# Altium schematic sheet BTN7960_DRIVER_SCH.SchDoc
size A2
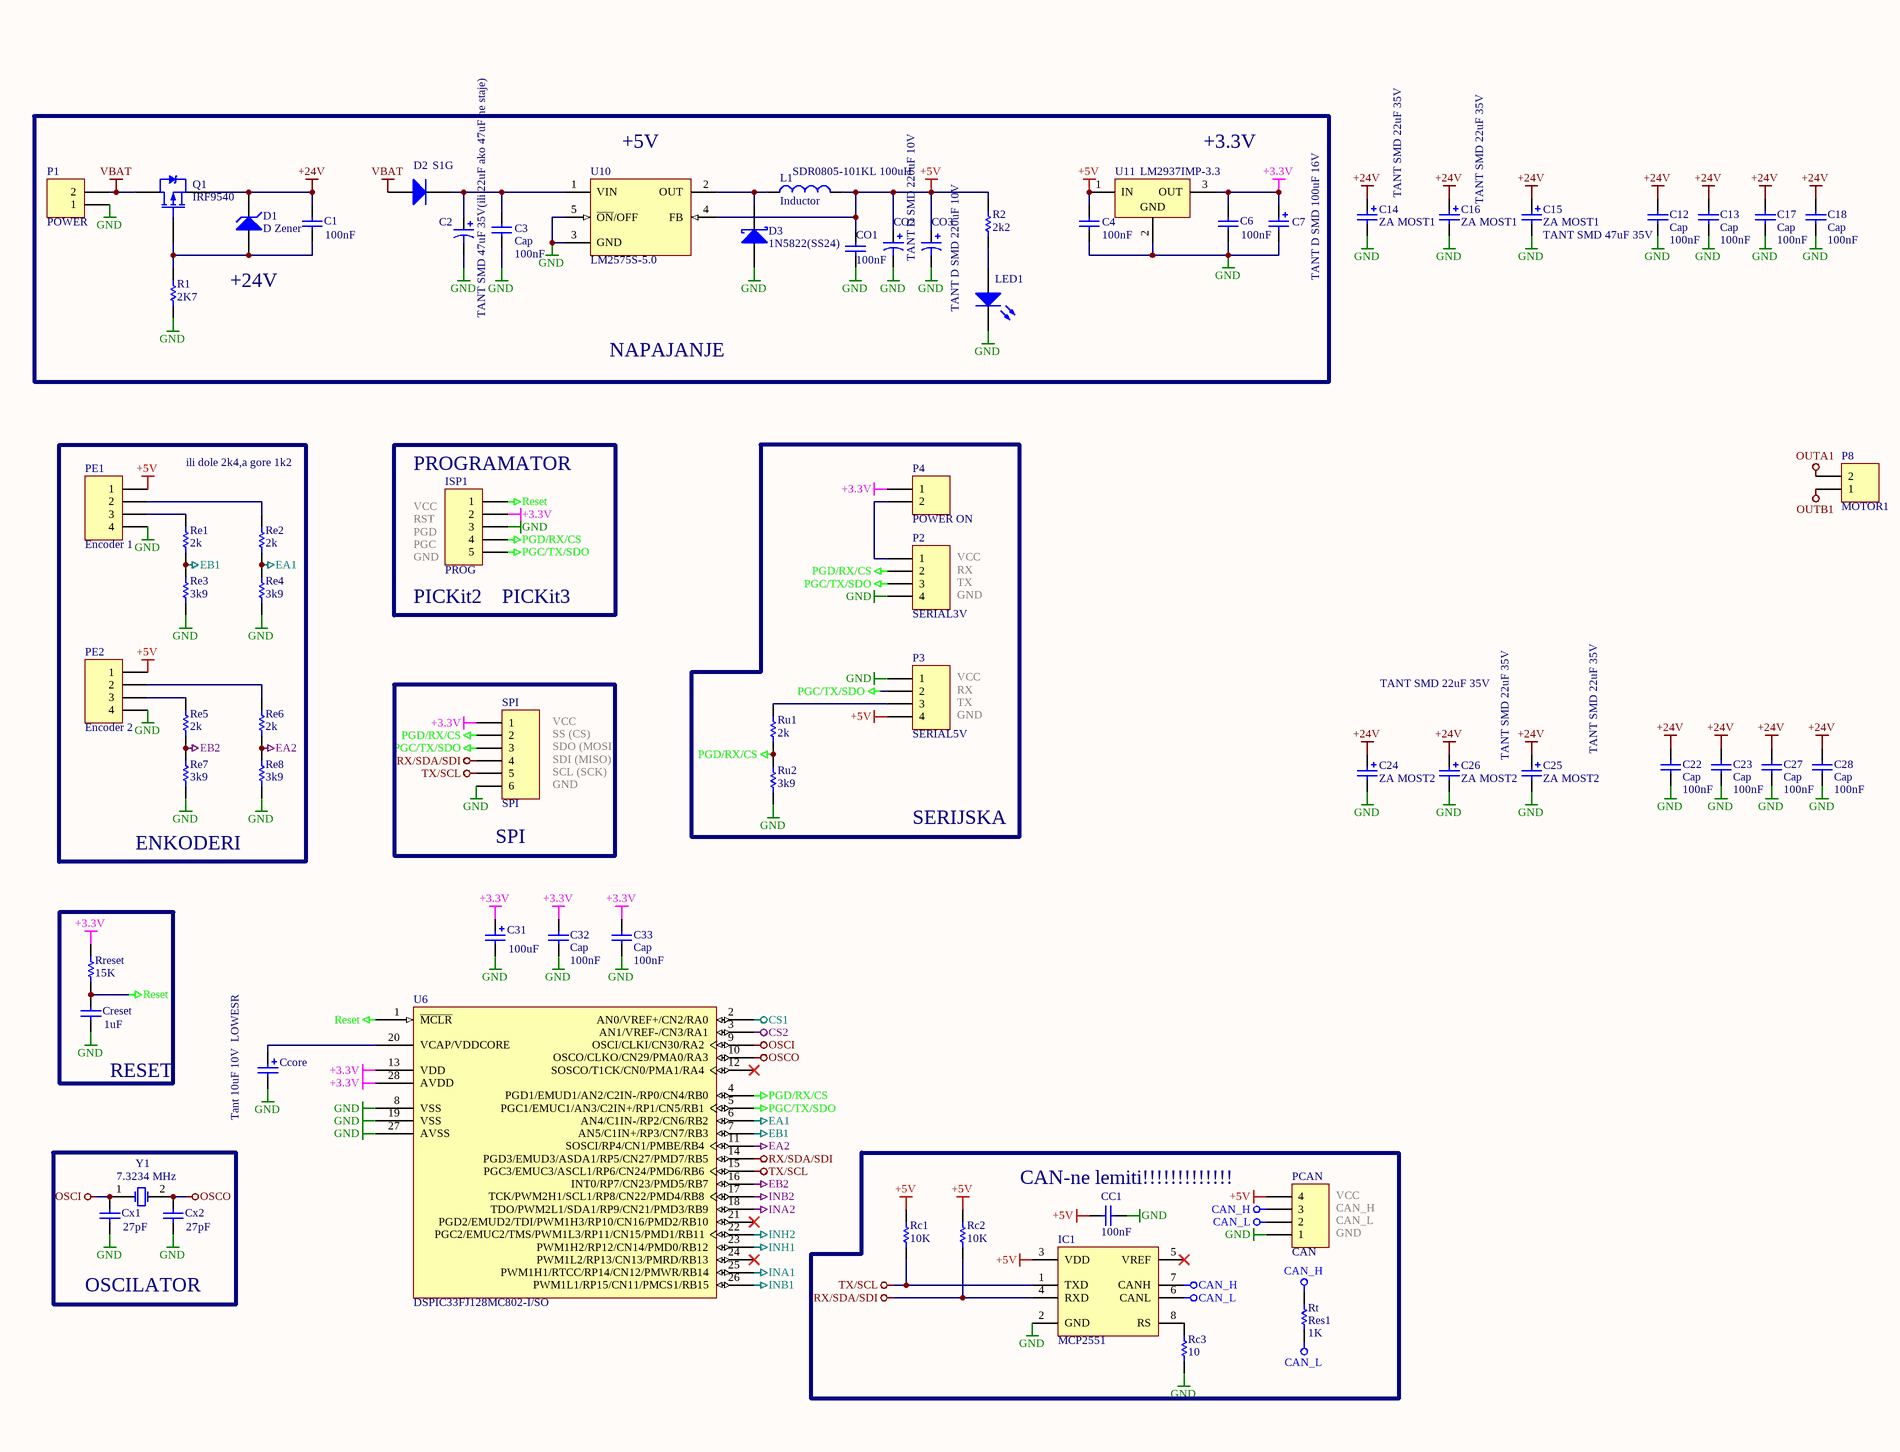
[diagram p0: BTN7960_DRIVER_SCH.SchDoc, left]
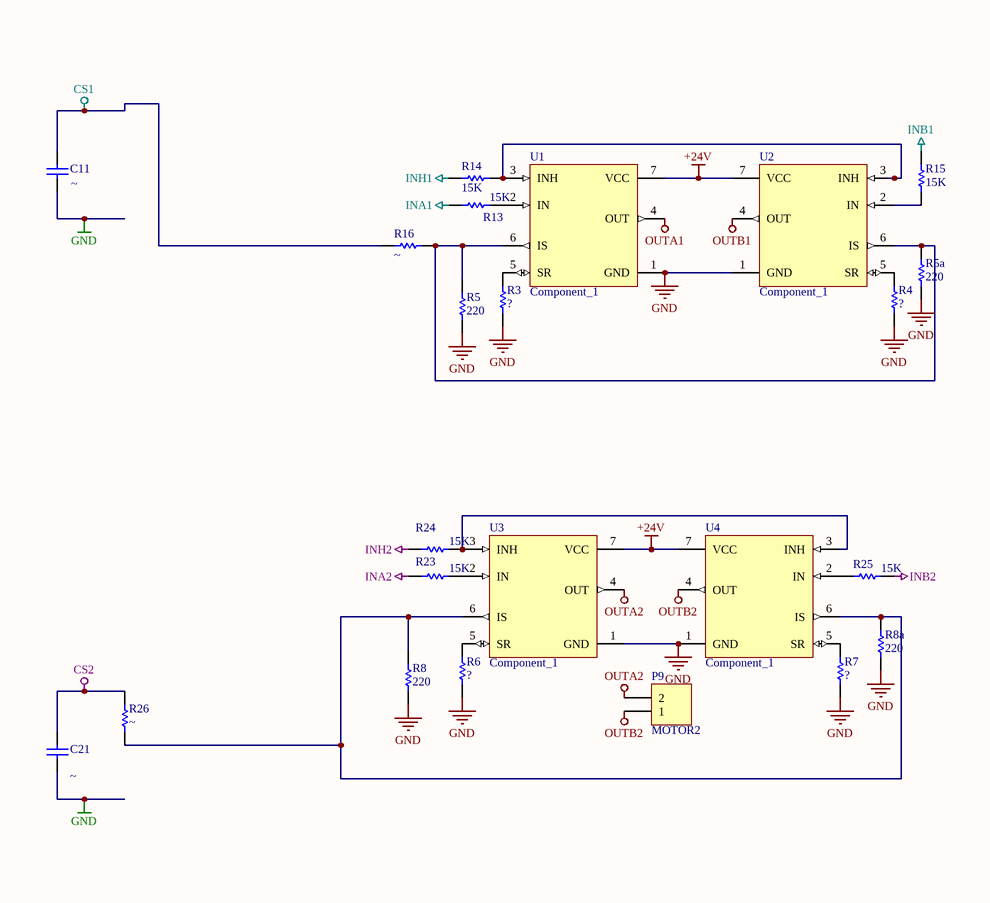
[diagram p1: BTN7960_DRIVER_SCH.SchDoc, right]

## Parts
C1  value 100nF  [1206]  (hidden comment: Cap)
C2  value TANT SMD 47uF 35V(ili 22uF ako 47uF ne staje)  [TC7343-2917]  (hidden comment: Cap Pol1)
C3  Cap  value 100nF  [1206]
C4  value 100nF  [1206]  (hidden comment: Cap)
C6  value 100nF  [1206]  (hidden comment: Cap)
C7  value TANT D SMD 100uF 16V  [TC7343-2917]  (hidden comment: ECAP)
C11  value ~  [1206]  (hidden comment: Cap)
C12  Cap  value 100nF  [1206]
C13  Cap  value 100nF  [1206]
C14  ZA MOST1  value TANT SMD 22uF 35V  [TC7343-2917]
C15  ZA MOST1  value TANT SMD 47uF 35V  [TC7343-2917]
C16  ZA MOST1  value TANT SMD 22uF 35V  [TC7343-2917]
C17  Cap  value 100nF  [1206]
C18  Cap  value 100nF  [1206]
C21  value ~  [1206]  (hidden comment: Cap)
C22  Cap  value 100nF  [1206]
C23  Cap  value 100nF  [1206]
C24  ZA MOST2  value TANT SMD 22uF 35V  [TC7343-2917]
C25  ZA MOST2  value TANT SMD 22uF 35V  [TC7343-2917]
C26  ZA MOST2  value TANT SMD 22uF 35V  [TC7343-2917]
C27  Cap  value 100nF  [1206]
C28  Cap  value 100nF  [1206]
C31  value 100uF  [TC7343-2917]  (hidden comment: ZA MOST1)
C32  Cap  value 100nF  [1206]
C33  Cap  value 100nF  [1206]
CC1  value 100nF  [1206]  (hidden comment: Cap)
Ccore  value Tant 10uF 10V  LOWESR  [TC7343-2917]  (hidden comment: ECAP)
CO1  value 100nF  [1206]  (hidden comment: Cap)
CO2  value TANT D SMD 220uF 10V  [TC7343-2917]  (hidden comment: Cap Pol1)
CO3  value TANT D SMD 220uF 10V  [TC7343-2917]  (hidden comment: Cap Pol1)
Creset  value 1uF  [1206]  (hidden comment: Cap)
Cx1  value 27pF  [1206]  (hidden comment: Cap)
Cx2  value 27pF  [1206]  (hidden comment: Cap)
D1  D Zener  [DSO-C2/X2.3]
D2  S1G  [DSO-C2/X2.3]
D3  1N5822(SS24)  [DSO-C2/X2.3]
IC1  MCP2551  [R-8_N]
ISP1  PROG  [HDR1X5]
L1  Inductor  value SDR0805-101KL 100uH  [SDR0805]
LD1  LED1  [RAD-0.1]
P1  POWER  [kombinacija]
P2  SERIAL3V  [HDR1X4]
P3  SERIAL5V  [BRXCON_4]
P4  POWER ON  [HDR1X2]
P8  MOTOR1  [kombinacija]
P9  MOTOR2  [kombinacija]
PCAN  CAN  [BRXCON_4]
PE1  Encoder 1  [BRXCON_4]
PE2  Encoder 2  [BRXCON_4]
Q1  IRF9540  [D2-PAK]
R1  value 2K7  [1206]  (hidden comment: res)
R2  value 2k2  [1206]  (hidden comment: res)
R3  res  [1206]  (value not drawn)
R4  res  [1206]  (value not drawn)
R5  value 220  [1206]  (hidden comment: res)
R5a  value 220  [1206]  (hidden comment: res)
R6  res  [1206]  (value not drawn)
R7  res  [1206]  (value not drawn)
R8  value 220  [1206]  (hidden comment: res)
R8a  value 220  [1206]  (hidden comment: res)
R13  value 15K  [1206]  (hidden comment: res)
R14  value 15K  [1206]  (hidden comment: res)
R15  value 15K  [1206]  (hidden comment: res)
R16  value ~  [1206]  (hidden comment: res)
R23  value 15K  [1206]  (hidden comment: res)
R24  value 15K  [1206]  (hidden comment: res)
R25  value 15K  [1206]  (hidden comment: res)
R26  value ~  [1206]  (hidden comment: res)
Rc1  value 10K  [1206]  (hidden comment: res)
Rc2  value 10K  [1206]  (hidden comment: res)
Rc3  value 10  [1206]  (hidden comment: res)
Re1  value 2k  [1206]  (hidden comment: res)
Re2  value 2k  [1206]  (hidden comment: res)
Re3  value 3k9  [1206]  (hidden comment: res)
Re4  value 3k9  [1206]  (hidden comment: res)
Re5  value 2k  [1206]  (hidden comment: res)
Re6  value 2k  [1206]  (hidden comment: res)
Re7  value 3k9  [1206]  (hidden comment: res)
Re8  value 3k9  [1206]  (hidden comment: res)
Rreset  value 15K  [1206]  (hidden comment: res)
Rt  Res1  value 1K  [1206]
Ru1  value 2k  [1206]  (hidden comment: res)
Ru2  value 3k9  [1206]  (hidden comment: res)
SPI  SPI  [BRXCON_6]
U1  Component_1  [to263-7]
U2  Component_1  [to263-7]
U3  Component_1  [to263-7]
U4  Component_1  [to263-7]
U6  DSPIC33FJ128MC802-I/SO  [SOIC-SO28_N]
U10  LM2575S-5.0  [TO-263(5)]
U11  LM2937IMP-3.3  [SOT223]
Y1  7.3234 MHz  [HC-49U]

## Nets
+3.3V: C6.2 C7.1 C31.1 C32.2 C33.2 ISP1.2 P4.1 Rreset.1 SPI.1 U6.13(VDD) U6.28(AVDD) U11.3(OUT)
+5V: C4.2 CC1.2 CO1.2 CO2.1 CO3.1 IC1.3(VDD) L1.2 P3.4 PCAN.4 PE1.1 PE2.1 R2.2 Rc1.1 Rc2.1 U10.4(FB) U11.1(IN)
+24V: C1.2 C12.2 C13.2 C14.1 C15.1 C16.1 C17.2 C18.2 C22.2 C23.2 C24.1 C25.1 C26.1 C27.2 C28.2 D1.2(K) Q1.3(S) U1.7(VCC) U2.7(VCC) U3.7(VCC) U4.7(VCC)
CAN_H: IC1.7(CANH) PCAN.3 Rt.2
CAN_L: IC1.6(CANL) PCAN.2 Rt.1
CS1: C11.2 R16.1 U6.2(AN0/VREF+/CN2/RA0)
CS2: C21.2 R26.1 U6.3(AN1/VREF-/CN3/RA1)
EA1: Re2.2 Re4.1 U6.6(AN4/C1IN-/RP2/CN6/RB2)
EA2: Re6.2 Re8.1 U6.11(SOSCI/RP4/CN1/PMBE/RB4)
EB1: Re1.2 Re3.1 U6.7(AN5/C1IN+/RP3/CN7/RB3)
EB2: Re5.2 Re7.1 U6.16(INT0/RP7/CN23/PMD5/RB7)
GND: C2.2 C3.1 C4.1 C6.1 C7.2 C11.1 C12.1 C13.1 C14.2 C15.2 C16.2 C17.1 C18.1 C21.1 C22.1 C23.1 C24.2 C25.2 C26.2 C27.1 C28.1 C31.2 C32.1 C33.1 CC1.1 Ccore.2 CO1.1 CO2.2 CO3.2 Creset.1 Cx1.1 Cx2.1 D3.1(A) IC1.2(GND) ISP1.3 LD1.2(K) P1.1 P2.4 P3.1 PCAN.1 PE1.4 PE2.4 R1.1 R3.2 R4.2 R5.2 R5a.2 R6.2 R7.2 R8.2 R8a.2 Rc3.2 Re3.2 Re4.2 Re7.2 Re8.2 Ru2.2 SPI.6 U1.1(GND) U2.1(GND) U3.1(GND) U4.1(GND) U6.8(VSS) U6.19(VSS) U6.27(AVSS) U10.3(GND) U10.5(~{ON}/OFF) U11.2(GND)
INA1: R13.2 U6.25(PWM1H1/RTCC/RP14/CN12/PMWR/RB14)
INA2: R23.2 U6.18(TDO/PWM2L1/SDA1/RP9/CN21/PMD3/RB9)
INB1: R15.1 U6.26(PWM1L1/RP15/CN11/PMCS1/RB15)
INB2: R25.1 U6.17(TCK/PWM2H1/SCL1/RP8/CN22/PMD4/RB8)
INH1: R14.1 U6.23(PWM1H2/RP12/CN14/PMD0/RB12)
INH2: R24.2 U6.22(PGC2/EMUC2/TMS/PWM1L3/RP11/CN15/PMD1/RB11)
OSCI: Cx1.2 U6.9(OSCI/CLKI/CN30/RA2) Y1.1(OSC1)
OSCO: Cx2.2 U6.10(OSCO/CLKO/CN29/PMA0/RA3) Y1.2(OSC2)
OUTA1: P8.2 U1.4(OUT)
OUTA2: P9.2 U3.4(OUT)
OUTB1: P8.1 U2.4(OUT)
OUTB2: P9.1 U4.4(OUT)
PGC/TX/SDO: ISP1.5 P2.3 P3.2 SPI.3 U6.5(PGC1/EMUC1/AN3/C2IN+/RP1/CN5/RB1)
PGD/RX/CS: ISP1.4 P2.2 Ru1.2 Ru2.1 SPI.2 U6.4(PGD1/EMUD1/AN2/C2IN-/RP0/CN4/RB0)
Reset: Creset.2 ISP1.1 Rreset.2 U6.1(~{MCLR})
RX/SDA/SDI: IC1.4(RXD) Rc2.2 SPI.4 U6.14(PGD3/EMUD3/ASDA1/RP5/CN27/PMD7/RB5)
TX/SCL: IC1.1(TXD) Rc1.2 SPI.5 U6.15(PGC3/EMUC3/ASCL1/RP6/CN24/PMD6/RB6)
VBAT: D2.1(A) P1.2 Q1.2(D)
NetC1_1: C1.1 D1.1(A) Q1.1(G) R1.2
NetC2_1: C2.1 C3.2 D2.2(K) U10.1(VIN)
NetCcore_1: Ccore.1 U6.20(VCAP/VDDCORE)
NetD3_2: D3.2(K) L1.1 U10.2(OUT)
NetIC1_8: IC1.8(RS) Rc3.1
NetLD1_1: LD1.1(A) R2.1
NetP2_1: P2.1 P4.2
NetP3_3: P3.3 Ru1.1
NetPE1_2: PE1.2 Re2.1
NetPE1_3: PE1.3 Re1.1
NetPE2_2: PE2.2 Re6.1
NetPE2_3: PE2.3 Re5.1
NetR3_1: R3.1 U1.5(SR)
NetR4_1: R4.1 U2.5(SR)
NetR5_1: R5.1 R5a.1 R16.2 U1.6(IS) U2.6(IS)
NetR6_1: R6.1 U3.5(SR)
NetR7_1: R7.1 U4.5(SR)
NetR8_1: R8.1 R8a.1 R26.2 U3.6(IS) U4.6(IS)
NetR13_1: R13.1 U1.2(IN)
NetR14_2: R14.2 U1.3(INH) U2.3(INH)
NetR15_2: R15.2 U2.2(IN)
NetR23_1: R23.1 U3.2(IN)
NetR24_1: R24.1 U3.3(INH) U4.3(INH)
NetR25_2: R25.2 U4.2(IN)

Not connected (* = marked no-connect by the designer): IC1 5(VREF)*; U6 12(SOSCO/T1CK/CN0/PMA1/RA4)* 21(PGD2/EMUD2/TDI/PWM1H3/RP10/CN16/PMD2/RB10)* 24(PWM1L2/RP13/CN13/PMRD/RB13)*

## Notes on the sheet
- (near U10) +5V
- +3.3V
- +24V
- NAPAJANJE
- ili dole 2k4,a gore 1k2
- (near ISP1) PROGRAMATOR
- PGD
- GND
- VCC
- RST
- PGC
- (near P2) RX
- (near ISP1) PICKit2
- (near ISP1) PICKit3
- (near P2) TX
- (near P2) GND
- (near P3) VCC
- (near P3) RX
- SS (CS)
- SDO (MOSI)
- (near P3) TX
- (near P3) GND
- SDI (MISO)
- SCL (SCK)
- SERIJSKA
- ENKODERI
- (near SPI) SPI
- (near Creset) RESET
- (near PCAN) CAN-ne lemiti!!!!!!!!!!!!!
- (near PCAN) VCC
- (near PCAN) CAN_L
- (near PCAN) GND
- (near PCAN) CAN_H
- OSCILATOR

## Library data of the parts
C1 C3 C4 C6 C11-C13 C17 C18 C21-C23 C27 C28 C32 C33 CC1 CO1 Creset Cx1 Cx2 = Cap: Capacitor; Published: 8-Jun-2000; LatestRevisionDate: 17-Jul-2002; LatestRevisionNote: Re-released for DXP Platform.; PackageReference: RAD-0.3; Publisher: Altium Limited
C2 C7 C14-C16 C24-C26 C31 Ccore CO2 CO3 = Cap Pol1: Polarized Capacitor (Radial); Published: 8-Jun-2000; LatestRevisionDate: 17-Jul-2002; LatestRevisionNote: Re-released for DXP Platform.; PackageReference: RB7.6-15; Publisher: Altium Limited
D1 = D Zener: Zener Diode; Published: 8-Jun-2000; LatestRevisionDate: 17-Jul-2002; LatestRevisionNote: Re-released for DXP Platform.; PackageReference: DIODE-0.7; Publisher: Altium Limited
D2 = Diode 1N914: High Conductance Fast Diode; Published: 8-Jun-2000; LatestRevisionDate: 17-Jul-2002; LatestRevisionNote: Re-released for DXP Platform.; DatasheetVersion: 1997; PackageReference: DO-35; Publisher: Altium Limited; Code_JEDEC: DO-204-AH; ComponentLink1Description: Manufacturer Link; ComponentLink1URL: http://www.fairchildsemi.com/; ComponentLink2Description: Datasheet; ComponentLink2URL: http://www.fairchildsemi.com/ds/1N%2F1N4448.pdf
D3 = D Schottky: Schottky Diode; Published: 8-Jun-2000; LatestRevisionDate: 17-Jul-2002; LatestRevisionNote: Re-released for DXP Platform.; PackageReference: SMB; Publisher: Altium Limited; Code_JEDEC: DO-214-AA
ISP1 = Header 5: Header, 5-Pin; LatestRevisionDate: 17-Jul-2002; LatestRevisionNote: Re-released for DXP Platform.; Publisher: Altium Limited
L1 = Inductor: Code_IEC: 1005; Published: 8-Jun-2000; LatestRevisionDate: 29-May-2009; LatestRevisionNote: IPC-7351 Footprint Added.; PackageReference: 0402-A; Publisher: Altium Limited; PackageDescription: Chip Inductor; Code_JEITA: 0402
LD1 = LED1: Typical RED GaAs LED; Published: 8-Jun-2000; Revision: July-2002: Re-released for DXP Platform.; Publisher: Altium Limited
P1 P4 P8 P9 = Header 2: Header, 2-Pin; LatestRevisionDate: 17-Jul-2002; LatestRevisionNote: Re-released for DXP Platform.; Publisher: Altium Limited
P2 P3 PCAN PE1 PE2 = Header 4: Header, 4-Pin; LatestRevisionDate: 17-Jul-2002; LatestRevisionNote: Re-released for DXP Platform.; Publisher: Altium Limited
Q1 = IRF9540: HEXFET P-Channel Power MOSFET; Note: Pin 2 is electrically connected to pin 4.; Published: 8-Jun-2000; LatestRevisionDate: 17-Jul-2002; LatestRevisionNote: Re-released for DXP Platform.; DatasheetVersion: PD-9.421C; PackageVersion: Feb-1997; PackageReference: TO-220AB; Publisher: Altium Limited; PackageDescription: TO, Thru-Hole, Vertical, Heatsink Mounted; 3 In-Line Leads; Pitch 2.54 mm; ComponentLink1Description: Manufacturer Link; ComponentLink1URL: http://www.irf.com/; ComponentLink2Description: Datasheet; ComponentLink2URL: http://www.irf.com/product-info/datasheets/data/irf9540.pdf
R1-R5 R5a R6-R8 R8a R13-R16 R23-R26 Rc1-Rc3 Re1-Re8 Rreset Rt Ru1 Ru2 = Res1: Resistor; Published: 8-Jun-2000; LatestRevisionDate: 17-Jul-2002; LatestRevisionNote: Re-released for DXP Platform.; PackageReference: AXIAL-0.3; Publisher: Altium Limited
  R3 R4 R6 R7: Value: ?
SPI = Header 6: Header, 6-Pin; LatestRevisionDate: 17-Jul-2002; LatestRevisionNote: Re-released for DXP Platform.; Publisher: Altium Limited
U1-U4 = Component_1: btn7960
U6 = DSPIC33FJ128MC802-I/SO: High-Performance 16-bit Digital Signal Controller, 128 KB Flash, 16 KB RAM, 28-Pin SOIC, Industrial Temperature; Published: 29-Jan-2009; DatasheetVersion: revB, Mar-2008; PackageVersion: revAW, Oct-2008; PackageReference: SOIC-SO28; Publisher: Altium Limited; PackageDescription: 28-Lead Plastic Small Outline (SO) - Wide 7.50mm Body [SOIC]; Code_JEDEC: MS-013; ComponentLink1Description: Manufacturer Link; ComponentLink1URL: http://www.microchip.com; ComponentLink2Description: Datasheet; ComponentLink2URL: http://ww1.microchip.com/downloads/en/DeviceDoc/70291B.pdf; ComponentLink3Description: Packaging Specification; ComponentLink3URL: http://ww1.microchip.com/downloads/en/PackagingSpec/00049AW.pdf
U10 = LM2575HVT-5.0: SIMPLE SWITCHER 1A Step-Down Voltage Regulator; Manufacturer: National Semiconductor; PackageTopMarking: NSUZXYTT*LM2575HVT*-5.0 P+; PowerWise: N; Published: 4-Dec-2008; DatasheetVersion: Apr-2007; PackageVersion: revJ, Jan-1992; PackageReference: T05A; Publisher: Altium Limited; PackageDescription: TO-220, Molded, 5 Lead, Straight; CompType: Switcher; PartNumber: LM2575HVT-5.0; RoHS: O; PinCount: 5; DigiKeyPartNumber: LM2575HVT-5.0-ND; Code_JEDEC: TO-220-AB; ComponentLink1Description: LM2575HV Datasheet; ComponentLink1URL: http://www.national.com/ds/LM/LM2575HV.pdf; ComponentLink2Description: LM2575HV Web Page; ComponentLink2URL: http://www.national.com/pf/LM/LM2575HV.html; ComponentLink3Description: T05A Package Page; ComponentLink3URL: http://www.national.com/packaging/folders/t05a.html
U11 = LM2937IMP-3.3: 500 mA Low-Dropout Regulator; Note: Tab is connected to GND; Published: 15-Apr-2002; DatasheetVersion: Dec-1997; PackageReference: TS3B; Publisher: Altium Limited; PackageDescription: D2-PAK; 3 Leads; Body 14.4 (inc. leads) x 10.4 mm (LxW max); ComponentLink1Description: Manufacturer Link; ComponentLink1URL: http://www.national.com/; ComponentLink2Description: Datasheet; ComponentLink2URL: http://www.national.com/ds.cgi/LM/LM2937.pdf; ComponentLink3Description: URL Link1; ComponentLink3URL: http://www.national.com/pf/LM/LM2937.html
Y1 = XTAL: Crystal Oscillator; Published: 8-Jun-2000; LatestRevisionDate: 17-Jul-2002; LatestRevisionNote: Re-released for DXP Platform.; Publisher: Altium Limited